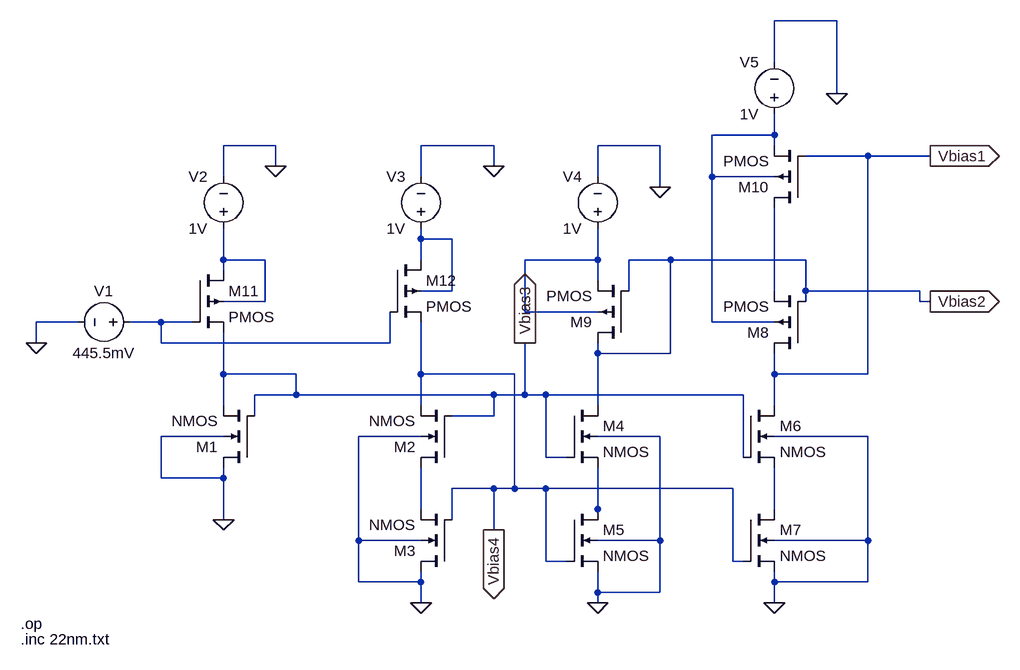
[diagram p0: schematic 22nm2nd.asc]
22nm2nd.asc, the LTspice schematic file:
Version 4
SHEET 1 1192 712
WIRE 912 -256 816 -256
WIRE 816 -192 816 -256
WIRE 912 -144 912 -256
WIRE 816 -80 816 -112
WIRE 816 -80 720 -80
WIRE 48 -64 -32 -64
WIRE 384 -64 272 -64
WIRE 640 -64 544 -64
WIRE 816 -64 816 -80
WIRE 960 -48 864 -48
WIRE 1056 -48 960 -48
WIRE 48 -32 48 -64
WIRE 384 -32 384 -64
WIRE -32 -16 -32 -64
WIRE 272 -16 272 -64
WIRE 544 -16 544 -64
WIRE 720 -16 720 -80
WIRE 816 -16 720 -16
WIRE 640 0 640 -64
WIRE 272 80 272 64
WIRE 320 80 272 80
WIRE -32 112 -32 64
WIRE 32 112 -32 112
WIRE 272 112 272 80
WIRE 544 112 544 64
WIRE 544 112 432 112
WIRE 656 112 592 112
WIRE 864 112 656 112
WIRE -32 128 -32 112
WIRE 544 144 544 112
WIRE 320 160 320 80
WIRE 320 160 272 160
WIRE 592 160 592 112
WIRE 816 160 816 32
WIRE 864 160 864 112
WIRE 1040 160 864 160
WIRE 32 176 32 112
WIRE 32 176 -32 176
WIRE 864 176 864 160
WIRE 1040 176 1040 160
WIRE 1056 176 1040 176
WIRE 432 192 432 112
WIRE 544 192 432 192
WIRE -256 208 -320 208
WIRE -128 208 -176 208
WIRE -80 208 -128 208
WIRE 720 208 720 -16
WIRE 816 208 720 208
WIRE -320 240 -320 208
WIRE -128 240 -128 208
WIRE 224 240 224 192
WIRE 224 240 -128 240
WIRE 544 256 544 240
WIRE 656 256 656 112
WIRE 656 256 544 256
WIRE -32 288 -32 224
WIRE 80 288 -32 288
WIRE 272 288 272 208
WIRE 416 288 272 288
WIRE 816 288 816 256
WIRE 960 288 960 -48
WIRE 960 288 816 288
WIRE 80 320 80 288
WIRE 80 320 16 320
WIRE 384 320 80 320
WIRE 432 320 432 240
WIRE 432 320 384 320
WIRE 464 320 432 320
WIRE 768 320 464 320
WIRE -32 336 -32 288
WIRE 272 336 272 288
WIRE 544 336 544 256
WIRE 816 336 816 288
WIRE 16 352 16 320
WIRE 384 352 384 320
WIRE 384 352 320 352
WIRE -32 384 -128 384
WIRE 272 384 176 384
WIRE 640 384 544 384
WIRE 960 384 816 384
WIRE 464 416 464 320
WIRE 496 416 464 416
WIRE 768 416 768 320
WIRE -128 448 -128 384
WIRE -32 448 -32 432
WIRE -32 448 -128 448
WIRE 384 464 320 464
WIRE 416 464 416 288
WIRE 416 464 384 464
WIRE 464 464 416 464
WIRE 752 464 464 464
WIRE 272 496 272 432
WIRE 544 496 544 432
WIRE 816 496 816 432
WIRE -32 512 -32 448
WIRE 320 512 320 464
WIRE 544 512 544 496
WIRE 384 528 384 464
WIRE 176 544 176 384
WIRE 272 544 176 544
WIRE 640 544 640 384
WIRE 640 544 544 544
WIRE 960 544 960 384
WIRE 960 544 816 544
WIRE 464 576 464 464
WIRE 496 576 464 576
WIRE 752 576 752 464
WIRE 768 576 752 576
WIRE 176 608 176 544
WIRE 272 608 272 592
WIRE 272 608 176 608
WIRE 816 608 816 592
WIRE 960 608 960 544
WIRE 960 608 816 608
WIRE 544 624 544 592
WIRE 640 624 640 544
WIRE 640 624 544 624
WIRE 272 640 272 608
WIRE 544 640 544 624
WIRE 816 640 816 608
FLAG -32 512 0
FLAG -320 240 0
FLAG 48 -32 0
FLAG 384 -32 0
FLAG 272 640 0
FLAG 544 640 0
FLAG 816 640 0
FLAG 640 0 0
FLAG 912 -144 0
FLAG 1056 -48 Vbias1
IOPIN 1056 -48 Out
FLAG 1056 176 Vbias2
IOPIN 1056 176 Out
FLAG 432 240 Vbias3
IOPIN 432 240 Out
FLAG 384 528 Vbias4
IOPIN 384 528 Out
SYMBOL voltage -160 208 R90
WINDOW 0 -32 56 VBottom 2
WINDOW 3 32 56 VTop 2
WINDOW 123 0 0 Left 0
WINDOW 39 0 0 Left 0
SYMATTR InstName V1
SYMATTR Value 445.5mV
SYMBOL voltage -32 80 R180
WINDOW 0 24 96 Left 2
WINDOW 3 24 16 Left 2
WINDOW 123 0 0 Left 0
WINDOW 39 0 0 Left 0
SYMATTR InstName V2
SYMATTR Value 1V
SYMBOL voltage 272 80 R180
WINDOW 0 24 96 Left 2
WINDOW 3 24 16 Left 2
WINDOW 123 0 0 Left 0
WINDOW 39 0 0 Left 0
SYMATTR InstName V3
SYMATTR Value 1V
SYMBOL nmos4 16 432 R180
SYMATTR InstName M1
SYMATTR Value2 l=22n w=80n
SYMBOL nmos4 320 432 R180
SYMATTR InstName M2
SYMATTR Value2 l=44n w=220n
SYMBOL nmos4 320 592 R180
SYMATTR InstName M3
SYMATTR Value2 l=44n w=220n
SYMBOL nmos4 496 336 R0
SYMATTR InstName M4
SYMATTR Value2 l=44n w=220n
SYMBOL nmos4 496 496 R0
SYMATTR InstName M5
SYMATTR Value2 l=44n w=220n
SYMBOL nmos4 768 336 R0
SYMATTR InstName M6
SYMATTR Value2 l=44n w=220n
SYMBOL nmos4 768 496 R0
SYMATTR InstName M7
SYMATTR Value2 l=44n w=528n
SYMBOL pmos4 864 256 R180
SYMATTR InstName M8
SYMATTR Value2 l=44n w=528n
SYMBOL pmos4 592 240 R180
SYMATTR InstName M9
SYMATTR Value2 l=350n w=4500n
SYMBOL pmos4 864 32 R180
SYMATTR InstName M10
SYMATTR Value2 l=15n w=2950000n
SYMBOL voltage 544 80 R180
WINDOW 0 24 96 Left 2
WINDOW 3 24 16 Left 2
WINDOW 123 0 0 Left 0
WINDOW 39 0 0 Left 0
SYMATTR InstName V4
SYMATTR Value 1V
SYMBOL voltage 816 -96 R180
WINDOW 0 24 96 Left 2
WINDOW 3 24 16 Left 2
WINDOW 123 0 0 Left 0
WINDOW 39 0 0 Left 0
SYMATTR InstName V5
SYMATTR Value 1V
SYMBOL pmos4 -80 128 R0
SYMATTR InstName M11
SYMATTR Value2 l=22n w=528n
SYMBOL pmos4 224 112 R0
SYMATTR InstName M12
SYMATTR Value2 l=22n w=528n
TEXT -344 672 Left 2 !.op
TEXT -344 696 Left 2 !.inc 22nm.txt

The netlist it stands for:
* 22nm2nd.asc
V1 N006 0 445.5mV
V2 N003 0 1V
V3 N002 0 1V
M1 0 Vbias3 Vbias3 0 NMOS l=22n w=80n
M2 N007 Vbias3 Vbias4 0 NMOS l=44n w=220n
M3 0 Vbias4 N007 0 NMOS l=44n w=220n
M4 Vbias2 Vbias3 N008 0 NMOS l=44n w=220n
M5 N008 Vbias4 0 0 NMOS l=44n w=220n
M6 Vbias1 Vbias3 N009 0 NMOS l=44n w=220n
M7 N009 Vbias4 0 0 NMOS l=44n w=528n
M8 Vbias1 Vbias2 N005 N001 PMOS l=44n w=528n
M9 Vbias2 Vbias2 N004 N004 PMOS l=350n w=4500n
M10 N005 Vbias1 N001 N001 PMOS l=15n w=2950000n
V4 N004 0 1V
V5 N001 0 1V
M11 N003 N006 Vbias3 N003 PMOS l=22n w=528n
M12 N002 N006 Vbias4 N002 PMOS l=22n w=528n
.model NMOS NMOS
.model PMOS PMOS
.lib standard.mos
.op
.inc 22nm.txt
.backanno
.end